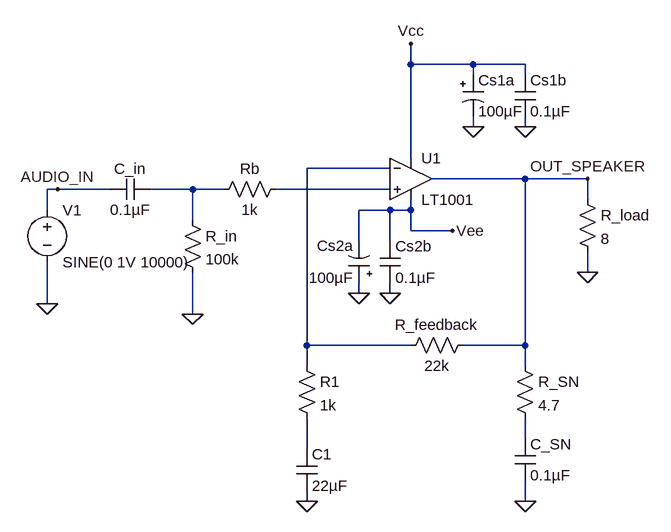
[diagram p0: schematic power_amp.asc]
power_amp.asc, the LTspice schematic file:
Version 4
SHEET 1 880 692
WIRE 192 0 192 -32
WIRE 288 0 192 0
WIRE 368 0 288 0
WIRE 288 16 288 0
WIRE 368 16 368 0
WIRE 288 96 288 80
WIRE 368 96 368 80
WIRE 192 144 192 0
WIRE 160 160 32 160
WIRE 368 176 224 176
WIRE 464 176 368 176
WIRE -352 192 -368 192
WIRE -272 192 -352 192
WIRE -144 192 -208 192
WIRE -96 192 -144 192
WIRE 160 192 -16 192
WIRE 464 208 464 176
WIRE -368 224 -368 192
WIRE 160 224 112 224
WIRE 192 224 192 208
WIRE 192 224 160 224
WIRE -144 240 -144 192
WIRE 192 256 192 224
WIRE 256 256 192 256
WIRE 112 272 112 224
WIRE 160 272 160 224
WIRE 464 320 464 288
WIRE 112 352 112 336
WIRE 160 352 160 336
WIRE -368 368 -368 304
WIRE -144 384 -144 320
WIRE 32 432 32 160
WIRE 192 432 32 432
WIRE 368 432 368 176
WIRE 368 432 272 432
WIRE 32 464 32 432
WIRE 368 464 368 432
WIRE 368 576 368 544
WIRE 32 592 32 544
WIRE 32 672 32 656
WIRE 368 672 368 640
FLAG 112 352 0
FLAG 256 256 Vee
FLAG 192 -32 Vcc
FLAG 288 96 0
FLAG 464 176 OUT_SPEAKER
FLAG 464 320 0
FLAG 368 672 0
FLAG 32 672 0
FLAG -368 368 0
FLAG -352 192 AUDIO_IN
FLAG 160 352 0
FLAG 368 96 0
FLAG -144 384 0
SYMBOL Opamps\\LT1001 192 112 R0
SYMATTR InstName U1
SYMBOL res 0 176 R90
WINDOW 0 0 56 VBottom 2
WINDOW 3 32 56 VTop 2
SYMATTR InstName Rb
SYMATTR Value 1k
SYMBOL res 288 416 R90
WINDOW 0 0 56 VBottom 2
WINDOW 3 32 56 VTop 2
SYMATTR InstName R_feedback
SYMATTR Value 22k
SYMBOL res 16 448 R0
SYMATTR InstName R1
SYMATTR Value 1k
SYMBOL cap 16 592 R0
SYMATTR InstName C1
SYMATTR Value 22µF
SYMBOL res 352 448 R0
SYMATTR InstName R_SN
SYMATTR Value 4.7
SYMBOL cap 352 576 R0
SYMATTR InstName C_SN
SYMATTR Value 0.1µF
SYMBOL polcap 128 336 R180
WINDOW 0 24 57 Left 2
WINDOW 3 24 8 Left 2
SYMATTR InstName Cs2a
SYMATTR Value 100µF
SYMBOL polcap 272 16 R0
SYMATTR InstName Cs1a
SYMATTR Value 100µF
SYMBOL res 448 192 R0
SYMATTR InstName R_load
SYMATTR Value 8
SYMBOL voltage -368 208 R0
WINDOW 123 0 0 Left 2
WINDOW 39 0 0 Left 2
SYMATTR InstName V1
SYMATTR Value SINE(0 1V 10000)
SYMBOL cap 352 16 R0
SYMATTR InstName Cs1b
SYMATTR Value 0.1µF
SYMBOL cap 144 272 R0
SYMATTR InstName Cs2b
SYMATTR Value 0.1µF
SYMBOL cap -208 176 R90
WINDOW 0 0 32 VBottom 2
WINDOW 3 32 32 VTop 2
SYMATTR InstName C_in
SYMATTR Value 0.1µF
SYMBOL res -160 224 R0
SYMATTR InstName R_in
SYMATTR Value 100k

The netlist it stands for:
* power_amp.asc
XU1 N003 N001 Vcc Vee OUT_SPEAKER LT1001  ; pins In+ In- V+ V- OUT
Rb N003 N002 1k
R_feedback OUT_SPEAKER N001 22k
R1 N001 N005 1k
C1 N005 0 22µF
R_SN OUT_SPEAKER N004 4.7
C_SN N004 0 0.1µF
Cs2a 0 Vee 100µF
Cs1a Vcc 0 100µF
R_load OUT_SPEAKER 0 8
V1 AUDIO_IN 0 SINE(0 1V 10000)
Cs1b Vcc 0 0.1µF
Cs2b Vee 0 0.1µF
C_in N002 AUDIO_IN 0.1µF
R_in N002 0 100k
.lib LTC.lib
.backanno
.end